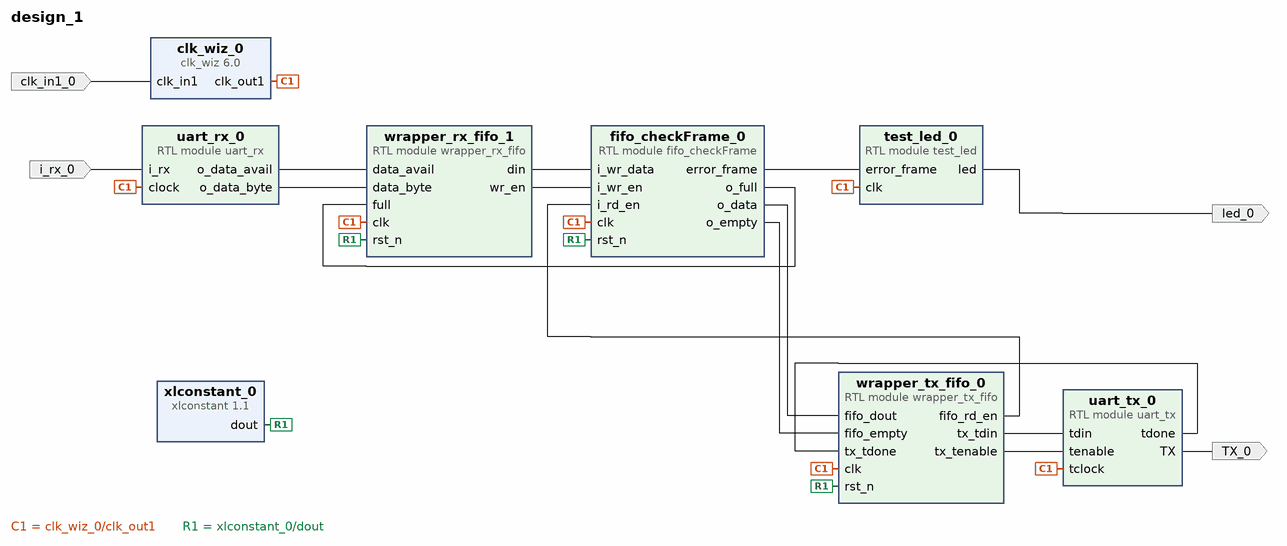
[diagram p0: block diagram of the top level]
# Vivado block design design_1, xc7z010clg400-1, Vivado 2022.2
create_bd_design design_1

create_bd_port -dir I i_rx_0
create_bd_port -dir O TX_0
create_bd_port -dir I -type clk clk_in1_0
set_property -dict {CONFIG.FREQ_HZ 125000000} [get_bd_ports clk_in1_0]
create_bd_port -dir O led_0

create_bd_cell -type module -reference wrapper_rx_fifo wrapper_rx_fifo_1
create_bd_cell -type ip -vlnv xilinx.com:ip:xlconstant:1.1 xlconstant_0
create_bd_cell -type module -reference wrapper_tx_fifo wrapper_tx_fifo_0
create_bd_cell -type ip -vlnv xilinx.com:ip:clk_wiz:6.0 clk_wiz_0
set_property -dict [list \
  CONFIG.CLKIN1_JITTER_PS 80.0 \
  CONFIG.CLKOUT1_JITTER 119.348 \
  CONFIG.CLKOUT1_PHASE_ERROR 96.948 \
  CONFIG.CLKOUT1_REQUESTED_OUT_FREQ 125.000 \
  CONFIG.MMCM_CLKFBOUT_MULT_F 8.000 \
  CONFIG.MMCM_CLKIN1_PERIOD 8.000 \
  CONFIG.MMCM_CLKOUT0_DIVIDE_F 8.000 \
  CONFIG.PRIM_IN_FREQ 125.000 \
  CONFIG.USE_LOCKED false \
  CONFIG.USE_RESET false \
] [get_bd_cells clk_wiz_0]
create_bd_cell -type module -reference test_led test_led_0
create_bd_cell -type module -reference fifo_checkFrame fifo_checkFrame_0
create_bd_cell -type module -reference uart_rx uart_rx_0
create_bd_cell -type module -reference uart_tx uart_tx_0

# ---- connections ----

connect_bd_net -net clk_in1_0_1 [get_bd_ports clk_in1_0] [get_bd_pins clk_wiz_0/clk_in1]
connect_bd_net -net clock_0_1 [get_bd_pins clk_wiz_0/clk_out1] \
  [get_bd_pins wrapper_rx_fifo_1/clk] [get_bd_pins wrapper_tx_fifo_0/clk] [get_bd_pins test_led_0/clk] \
  [get_bd_pins fifo_checkFrame_0/clk] [get_bd_pins uart_rx_0/clock] [get_bd_pins uart_tx_0/tclock]
connect_bd_net [get_bd_pins fifo_checkFrame_0/error_frame] [get_bd_pins test_led_0/error_frame]
connect_bd_net [get_bd_pins fifo_checkFrame_0/o_data] [get_bd_pins wrapper_tx_fifo_0/fifo_dout]
connect_bd_net [get_bd_pins fifo_checkFrame_0/o_empty] [get_bd_pins wrapper_tx_fifo_0/fifo_empty]
connect_bd_net [get_bd_pins fifo_checkFrame_0/o_full] [get_bd_pins wrapper_rx_fifo_1/full]
connect_bd_net -net i_rx_0_1 [get_bd_ports i_rx_0] [get_bd_pins uart_rx_0/i_rx]
connect_bd_net [get_bd_pins test_led_0/led] [get_bd_ports led_0]
connect_bd_net [get_bd_pins uart_rx_0/o_data_avail] [get_bd_pins wrapper_rx_fifo_1/data_avail]
connect_bd_net [get_bd_pins uart_rx_0/o_data_byte] [get_bd_pins wrapper_rx_fifo_1/data_byte]
connect_bd_net [get_bd_pins uart_tx_0/TX] [get_bd_ports TX_0]
connect_bd_net [get_bd_pins uart_tx_0/tdone] [get_bd_pins wrapper_tx_fifo_0/tx_tdone]
connect_bd_net [get_bd_pins wrapper_rx_fifo_1/din] [get_bd_pins fifo_checkFrame_0/i_wr_data]
connect_bd_net [get_bd_pins wrapper_rx_fifo_1/wr_en] [get_bd_pins fifo_checkFrame_0/i_wr_en]
connect_bd_net [get_bd_pins wrapper_tx_fifo_0/fifo_rd_en] [get_bd_pins fifo_checkFrame_0/i_rd_en]
connect_bd_net [get_bd_pins wrapper_tx_fifo_0/tx_tdin] [get_bd_pins uart_tx_0/tdin]
connect_bd_net [get_bd_pins wrapper_tx_fifo_0/tx_tenable] [get_bd_pins uart_tx_0/tenable]
connect_bd_net [get_bd_pins xlconstant_0/dout] \
  [get_bd_pins wrapper_rx_fifo_1/rst_n] [get_bd_pins wrapper_tx_fifo_0/rst_n] [get_bd_pins fifo_checkFrame_0/rst_n]

validate_bd_design
save_bd_design
